# Altium schematic sheet Ethernet_Phy.SchDoc
size 594 x 420 mm; SheetNumber: 3; SheetTotal: 4
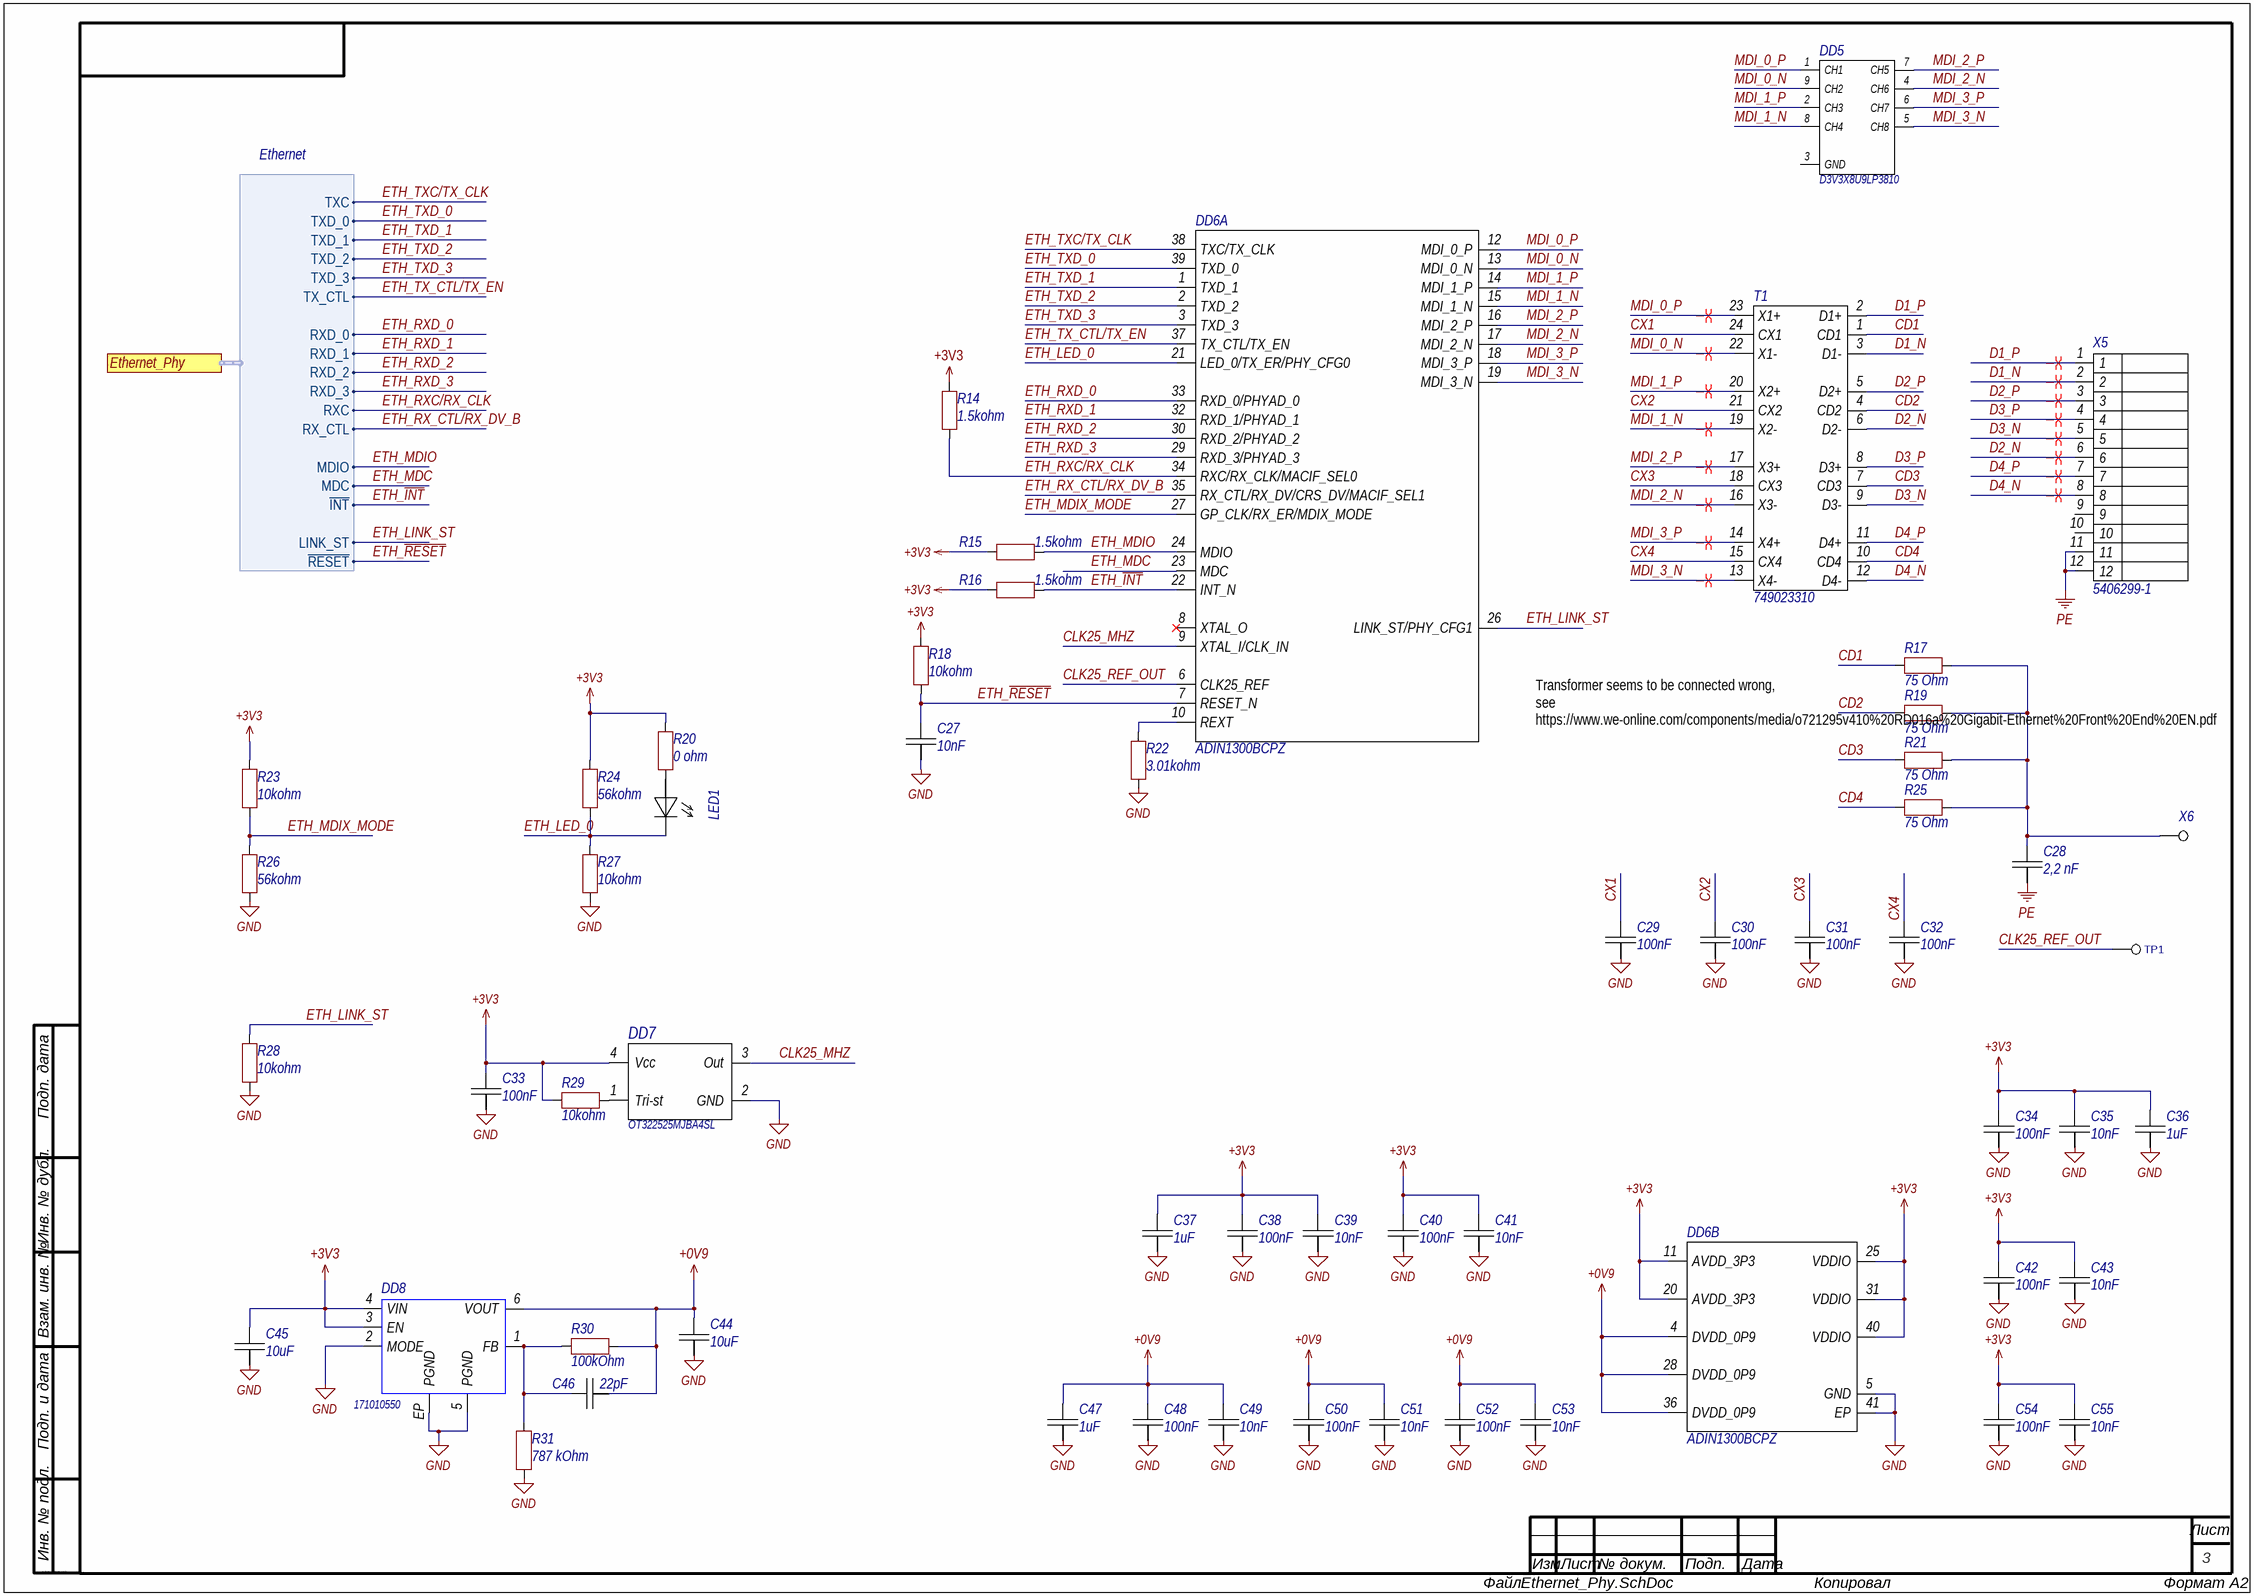
[diagram p0: Ethernet_Phy.SchDoc]

## Parts
C27  value 10nF  [CAP0402]  (hidden comment: 10nF 50V)
C28  value 2,2 nF  [CAPC1206(3216)150_L]  (hidden comment: 2,2 nF 2 kV)
C29  value 100nF  [CAP0402]  (hidden comment: 100nF 50V)
C30  value 100nF  [CAP0402]  (hidden comment: 100nF 50V)
C31  value 100nF  [CAP0402]  (hidden comment: 100nF 50V)
C32  value 100nF  [CAP0402]  (hidden comment: 100nF 50V)
C33  value 100nF  [CAP0402]  (hidden comment: 100nF 50V)
C34  value 100nF  [CAP0402]  (hidden comment: 100nF 50V)
C35  value 10nF  [CAP0402]  (hidden comment: 10nF 50V)
C36  value 1uF  [CAP0402]  (hidden comment: 1uF 25V)
C37  value 1uF  [CAP0402]  (hidden comment: 1uF 25V)
C38  value 100nF  [CAP0402]  (hidden comment: 100nF 50V)
C39  value 10nF  [CAP0402]  (hidden comment: 10nF 50V)
C40  value 100nF  [CAP0402]  (hidden comment: 100nF 50V)
C41  value 10nF  [CAP0402]  (hidden comment: 10nF 50V)
C42  value 100nF  [CAP0402]  (hidden comment: 100nF 50V)
C43  value 10nF  [CAP0402]  (hidden comment: 10nF 50V)
C44  value 10uF  [CAPC0603N]  (hidden comment: 10uF 25V)
C45  value 10uF  [CAPC0603N]  (hidden comment: 10uF 25V)
C46  value 22pF  [CAP0402]  (hidden comment: 22pF 50V)
C47  value 1uF  [CAP0402]  (hidden comment: 1uF 25V)
C48  value 100nF  [CAP0402]  (hidden comment: 100nF 50V)
C49  value 10nF  [CAP0402]  (hidden comment: 10nF 50V)
C50  value 100nF  [CAP0402]  (hidden comment: 100nF 50V)
C51  value 10nF  [CAP0402]  (hidden comment: 10nF 50V)
C52  value 100nF  [CAP0402]  (hidden comment: 100nF 50V)
C53  value 10nF  [CAP0402]  (hidden comment: 10nF 50V)
C54  value 100nF  [CAP0402]  (hidden comment: 100nF 50V)
C55  value 10nF  [CAP0402]  (hidden comment: 10nF 50V)
DD5  MPN: D3V3X8U9LP3810  [U-DFN3810-9]
DD6  MPN: ADIN1300BCPZ  [LFCSP-40]  (parts A,B of 2)
DD7  MPN: OT322525MJBA4SL  [TSX-3225_V]
DD8  (no value)  [171010550]
LED1  Green  [LED0805]  (value not drawn)
R14  1.5kohm  [RESC0402(1005)_M]
R15  1.5kohm  [RESC0402(1005)_M]
R16  1.5kohm  [RESC0402(1005)_M]
R17  75 Ohm  [RESC0603N]
R18  10kohm  [RESC0402(1005)_M]
R19  75 Ohm  [RESC0603N]
R20  0 ohm  [RESC0402(1005)_M]
R21  75 Ohm  [RESC0603N]
R22  3.01kohm  [RESC0402(1005)_M]
R23  10kohm  [RESC0402(1005)_M]
R24  56kohm  [RESC0402(1005)_M]
R25  75 Ohm  [RESC0603N]
R26  56kohm  [RESC0402(1005)_M]
R27  10kohm  [RESC0402(1005)_M]
R28  10kohm  [RESC0402(1005)_M]
R29  10kohm  [RESC0402(1005)_M]
R30  100kOhm  [RESC0402(1005)_M]
R31  787 kOhm  [RESC0805L]
T1  180 uH  [749023310]  (value not drawn)
TP1  TP-SINGLE-ROUND  [TP-ROUND-TOP-1.5]  (value not drawn)  (no BOM)
X5  5406299-1  [RJ-45_5406299-1]
X6  PLS1  [PLS1]  (value not drawn)  (no BOM)

## Ports
Ethernet_Phy (harness Ethernet)

## Harnesses
Ethernet: TXC, TXD_0, TXD_1, TXD_2, TXD_3, TX_CTL, RXD_0, RXD_1, RXD_2, RXD_3, RXC, RX_CTL, MDIO, MDC, ~{INT}, LINK_ST, ~{RESET}

## Nets
+0V9: C44.2 C46.1 C47.2 C48.2 C49.2 C50.2 C51.2 C52.2 C53.2 DD6.4(DVDD_0P9) DD6.28(DVDD_0P9) DD6.36(DVDD_0P9) DD8.6(VOUT) R30.1
+3V3: C33.2 C34.2 C35.2 C36.2 C37.2 C38.2 C39.2 C40.2 C41.2 C42.2 C43.2 C45.2 C54.2 C55.2 DD6.11(AVDD_3P3) DD6.20(AVDD_3P3) DD6.25(VDDIO) DD6.31(VDDIO) DD6.40(VDDIO) DD7.4(Vcc) DD8.3(EN) DD8.4(VIN) R14.2 R15.1 R16.1 R18.2 R20.2 R23.2 R24.2 R29.1
GND: C27.1 C29.1 C30.1 C31.1 C32.1 C33.1 C34.1 C35.1 C36.1 C37.1 C38.1 C39.1 C40.1 C41.1 C42.1 C43.1 C44.1 C45.1 C47.1 C48.1 C49.1 C50.1 C51.1 C52.1 C53.1 C54.1 C55.1 DD6.5(GND) DD6.41(EP) DD7.2(GND) DD8.2(MODE) DD8.5(PGND) DD8.EP(PGND) R22.1 R26.1 R27.1 R28.1 R31.1
PE: C28.1 X5.11 X5.12
CD1: R17.2 T1.1(CD1)
CD2: R19.2 T1.4(CD2)
CD3: R21.2 T1.7(CD3)
CD4: R25.2 T1.10(CD4)
CLK25_MHZ: DD6.9(XTAL_I/CLK_IN) DD7.3(Out)
CLK25_REF_OUT: DD6.6(CLK25_REF) TP1.1
CX1: C29.2 T1.24(CX1)
CX2: C30.2 T1.21(CX2)
CX3: C31.2 T1.18(CX3)
CX4: C32.2 T1.15(CX4)
D1_N: T1.3(D1-) X5.2
D1_P: T1.2(D1+) X5.1
D2_N: T1.6(D2-) X5.6
D2_P: T1.5(D2+) X5.3
D3_N: T1.9(D3-) X5.5
D3_P: T1.8(D3+) X5.4
D4_N: T1.12(D4-) X5.8
D4_P: T1.11(D4+) X5.7
ETH_~{INT}: DD6.22(INT_N) R16.2 ; port Ethernet_Phy.~{INT}
ETH_LED_0: DD6.21(LED_0/TX_ER/PHY_CFG0) LED1.1(A) R24.1 R27.2
ETH_LINK_ST: DD6.26(LINK_ST/PHY_CFG1) R28.2 ; port Ethernet_Phy.LINK_ST
ETH_MDC: DD6.23(MDC) ; port Ethernet_Phy.MDC
ETH_MDIO: DD6.24(MDIO) R15.2 ; port Ethernet_Phy.MDIO
ETH_MDIX_MODE: DD6.27(GP_CLK/RX_ER/MDIX_MODE) R23.1 R26.2
ETH_~{RESET}: C27.2 DD6.7(RESET_N) R18.1 ; port Ethernet_Phy.~{RESET}
ETH_RX_CTL/RX_DV_B: DD6.35(RX_CTL/RX_DV/CRS_DV/MACIF_SEL1) ; port Ethernet_Phy.RX_CTL
ETH_RXC/RX_CLK: DD6.34(RXC/RX_CLK/MACIF_SEL0) R14.1 ; port Ethernet_Phy.RXC
ETH_RXD_0: DD6.33(RXD_0/PHYAD_0) ; port Ethernet_Phy.RXD_0
ETH_RXD_1: DD6.32(RXD_1/PHYAD_1) ; port Ethernet_Phy.RXD_1
ETH_RXD_2: DD6.30(RXD_2/PHYAD_2) ; port Ethernet_Phy.RXD_2
ETH_RXD_3: DD6.29(RXD_3/PHYAD_3) ; port Ethernet_Phy.RXD_3
ETH_TX_CTL/TX_EN: DD6.37(TX_CTL/TX_EN) ; port Ethernet_Phy.TX_CTL
ETH_TXC/TX_CLK: DD6.38(TXC/TX_CLK) ; port Ethernet_Phy.TXC
ETH_TXD_0: DD6.39(TXD_0) ; port Ethernet_Phy.TXD_0
ETH_TXD_1: DD6.1(TXD_1) ; port Ethernet_Phy.TXD_1
ETH_TXD_2: DD6.2(TXD_2) ; port Ethernet_Phy.TXD_2
ETH_TXD_3: DD6.3(TXD_3) ; port Ethernet_Phy.TXD_3
MDI_0_N: DD5.9(CH2) DD6.13(MDI_0_N) T1.22(X1-)
MDI_0_P: DD5.1(CH1) DD6.12(MDI_0_P) T1.23(X1+)
MDI_1_N: DD5.8(CH4) DD6.15(MDI_1_N) T1.19(X2-)
MDI_1_P: DD5.2(CH3) DD6.14(MDI_1_P) T1.20(X2+)
MDI_2_N: DD5.4(CH6) DD6.17(MDI_2_N) T1.16(X3-)
MDI_2_P: DD5.7(CH5) DD6.16(MDI_2_P) T1.17(X3+)
MDI_3_N: DD5.5(CH8) DD6.19(MDI_3_N) T1.13(X4-)
MDI_3_P: DD5.6(CH7) DD6.18(MDI_3_P) T1.14(X4+)
NetC28_2: C28.2 R17.1 R19.1 R21.1 R25.1 X6.1
NetC46_2: C46.2 DD8.1(FB) R30.2 R31.2
NetDD6_10: DD6.10(REXT) R22.2
NetDD7_1: DD7.1(Tri-st) R29.2
NetLED1_2: LED1.2(K) R20.1

Not connected (* = marked no-connect by the designer): DD5 3(GND); DD6 8(XTAL_O)*; X5 9 10

## Layout directives
differential pair; differential pair class Diff_100; net class Diff_pair: D1_N, D1_P, D2_N, D2_P, D3_N, D3_P, D4_N, D4_P, MDI_0_N, MDI_0_P, MDI_1_N, MDI_1_P, MDI_2_N, MDI_2_P, MDI_3_N, MDI_3_P

## Notes on the sheet
- Transformer seems to be connected wrong, see
  https://www.we-online.com/components/media/o721295v410%20RD016a%20Gigabit-Ethernet%20Front%20End%20EN.pdf
- Подп. дата
- Инв. № дубл.
- Взам. инв. №
- Подп. и дата
- Инв. № подл.
- Изм.
- Лист
- № докум.
- Подп.
- Дата
- ALTIUM GOSTBOM2.0 KEV
- Файл:
- Копировал
- Формат А2

## Library data of the parts
C27 C29-C43 C46-C55 = CAP0402: MntType: SMD; MSL: MSL 1; Package: =Footprint; RoHS: Comply; PartType: CHIP CERAMIC CAPACITOR; Pins: 2; BOMDescription: =MntType+' '+PartType+' '+Package+' '+Value+' '+Tolerance+' '+Voltage+' '+TempCoeff+' '+MPN; CFootprint: =Footprint; Part Number: CAP0402; ClassName: Capacitor; ComponentLink1Description: Datasheet
  C27 C29-C35 C38-C43 C46 C48-C55: Voltage: 50V
  C36 C37 C47: Voltage: 25V
C28 = CAPC: MntType: SMD; Voltage: 2 kV; MSL: MSL 1; Package: =Footprint; RoHS: Comply; PartType: CHIP CERAMIC CAPACITOR; Pins: 2; BOMDescription: =MntType+' '+PartType+' '+Package+' '+Value+' '+Tolerance+' '+Voltage+' '+TempCoeff+' '+MPN; CFootprint: =Footprint; Part Number: CAPC; ClassName: Capacitor; ComponentLink1Description: Datasheet
C44 C45 = CAPC: MntType: SMD; MSL: MSL 1; Package: =Footprint; RoHS: Comply; PartType: CHIP CERAMIC CAPACITOR; Pins: 2; BOMDescription: =MntType+' '+PartType+' '+Package+' '+Value+' '+Tolerance+' '+Voltage+' '+TempCoeff+' '+MPN; CFootprint: =Footprint; Voltage: 25V; Part Number: CAPC; ClassName: Capacitor; ComponentLink1Description: Datasheet
DD5 = D3V3X8U9LP3810: Manufacturer: DiodesInc; MntType: SMD; Part Number: D3V3X8U9LP3810; MSL: MSL 1; Package: =Footprint; RoHS: Comply; PartType: TVS; Pins: 9; BOMDescription: D3V3X8U9LP3810; CFootprint: =Footprint; ClassName: TVS; ComponentLink1Description: Datasheet; ComponentLink1URL: https://www.diodes.com/assets/Datasheets/D3V3X8U9LP3810.pdf
DD6 = ADIN1300BCPZ: Manufacturer: AD; PartTypeRUS: пїЅпїЅпїЅпїЅпїЅпїЅпїЅпїЅпїЅпїЅ; MntType: SMD; ID: 46; BOMDescriptionRUS: пїЅпїЅпїЅпїЅпїЅпїЅпїЅпїЅпїЅпїЅ ADIN1300BCPZ; Part Number: ADIN1300BCPZ; MSL: MSL 1; Package: =Footprint; RoHS: Comply; PartType: Ethernet Phy; Pins: 41; BOMDescription: ADIN1300BCPZ; CFootprint: =Footprint; ClassName: Ethernet Phy; ComponentLink1Description: Datasheet; ComponentLink1URL: https://www.analog.com/media/en/technical-documentation/data-sheets/ADIN1300.pdf
DD7 = OT322525MJBA4SL: Manufacturer: Yangxing Tech; Value: 25MHz; MntType: SMD; Part Number: OT322525MJBA4SL; MSL: MSL 1; Package: SMD3225; RoHS: Comply; PartType: Oscillator; Pins: 4; BOMDescription: OT322525MJBA4SL; CFootprint: =Footprint; ClassName: Oscillator; ComponentLink1Description: Datasheet; ComponentLink1URL: https://datasheet.lcsc.com/lcsc/2103291238_Yangxing-Tech-OT322525MJBA4SL_C669088.pdf
DD8 = 171010550: Manufacturer: WE; MntType: SMD; MPN: 171010550; Part Number: 171010550; MSL: MSL 1; Package: LGA-6EP; RoHS: Comply; PartType: Buck converter; Pins: 8; BOMDescription: 171010550; CFootprint: =Footprint; ClassName: Buck; ComponentLink1Description: Datasheet; ComponentLink1URL: https://www.we-online.com/catalog/datasheet/171010550_valid_from_2021-12-01.pdf
LED1 = LEDC0805: PartTypeRUS: пїЅпїЅпїЅпїЅпїЅпїЅпїЅпїЅпїЅ; MntType: SMD; ID: 197; MSL: MSL 5; Package: =Footprint; RoHS: Comply; PartType: CHIP LED; Pins: 2; BOMDescription: =MntType+' '+PartType+' '+Package+' '+Value+' '+Tolerance+' '+Voltage+' '+TempCoeff+' '+MPN; CFootprint: =Footprint; Value: Green; Part Number: LEDC0805; BOMDescriptionRUS: пїЅпїЅпїЅпїЅпїЅпїЅпїЅпїЅпїЅ; ClassName: LED; ComponentLink1Description: Datasheet
R14-R16 R18 R20 R23 R24 R26-R30 = RES0402: MntType: SMD; MSL: MSL 1; Package: =Footprint; RoHS: Comply; PartType: CHIP RESISTOR; Pins: 2; BOMDescription: =MntType+' '+PartType+' '+Package+' '+Value+' '+Tolerance+' '+Voltage+' '+TempCoeff+' '+MPN; CFootprint: =Footprint; Part Number: RES0402; ClassName: Resistor; ComponentLink1Description: Datasheet
  R14-R16: Value: 1.5kohm
  R18 R23 R27-R29: Value: 10kohm
  R20: Value: 0 ohm
  R24 R26: Value: 56kohm
  R30: Value: 100kOhm
R17 R19 R21 R25 = RES: MntType: SMD; MSL: MSL 1; Package: =Footprint; RoHS: Comply; PartType: CHIP RESISTOR; Pins: 2; BOMDescription: =MntType+' '+PartType+' '+Package+' '+Value+' '+Tolerance+' '+Voltage+' '+TempCoeff+' '+MPN; CFootprint: =Footprint; Value: 75 Ohm; Part Number: RES; ClassName: Resistor; ComponentLink1Description: Datasheet
R22 = RES0402: MntType: SMD; Tolerance: 1%; MSL: MSL 1; Package: =Footprint; RoHS: Comply; PartType: CHIP RESISTOR; Pins: 2; BOMDescription: =MntType+' '+PartType+' '+Package+' '+Value+' '+Tolerance+' '+Voltage+' '+TempCoeff+' '+MPN; CFootprint: =Footprint; Value: 3.01kohm; Part Number: RES0402; ClassName: Resistor; ComponentLink1Description: Datasheet
R31 = RES: PartTypeRUS: пїЅпїЅпїЅпїЅпїЅпїЅпїЅпїЅ; MntType: SMD; ID: 300; MSL: MSL 1; Package: =Footprint; RoHS: Comply; PartType: CHIP RESISTOR; Pins: 2; BOMDescription: =MntType+' '+PartType+' '+Package+' '+Value+' '+Tolerance+' '+Voltage+' '+TempCoeff+' '+MPN; CFootprint: =Footprint; Value: 787 kOhm; Part Number: RES; ClassName: Resistor; ComponentLink1Description: Datasheet; BOMDescriptionRUS: пїЅпїЅпїЅпїЅпїЅпїЅпїЅпїЅ
T1 = 749023310: WE-LAN AQ SMT Transformer, 1000 Base-T, PoE (up to 350 mA), 180uH; Manufacturer: WE; MntType: SMD; MPN: 749023310; Part Number: 749023310; MSL: MSL 1; RoHS: Comply; PartType: Transformer; BOMDescription: 749023310; CFootprint: =Footprint; ClassName: Transformer; ComponentLink1Description: Datasheet; ComponentLink1URL: https://www.we-online.com/catalog/datasheet/749023310.pdf
TP1 = TP-SINGLE-ROUND: MntType: SMD; MSL: MSL 1; RoHS: Comply; BOMDescription: SMD; CFootprint: =Footprint; Part Number: TP-SINGLE-ROUND; ClassName: Touch; ComponentLink1Description: Datasheet
X5 = 5406299-1: Manufacturer: TE; MntType: DIP; System: Connector; MPN: 5406299-1; Part Number: 5406299-1; MSL: MSL 1; Package: RJ45; RoHS: Comply; PartType: CONNECTOR; Pins: 12; BOMDescription: 5406299-1; CFootprint: =Footprint; ClassName: Connector; ComponentLink1Description: Datasheet; ComponentLink1URL: https://www.te.com/commerce/DocumentDelivery/DDEController?Action=srchrtrv&DocNm=5406299&DocType=Customer+Drawing&DocLang=English&PartCntxt=5406299-1&DocFormat=pdf
X6 = Test_PLS1: MntType: DIP; BOMDescription: DIP PLS; System: Connector; MSL: MSL 1; RoHS: Comply; PartType: PLS; Pins: 1; CFootprint: =Footprint; Part Number: Test_PLS1; ClassName: Test_Point; ComponentLink1Description: Datasheet